# EAGLE design avoccado-avr-pcb-micro-a1 (EAGLE 7.2.0)
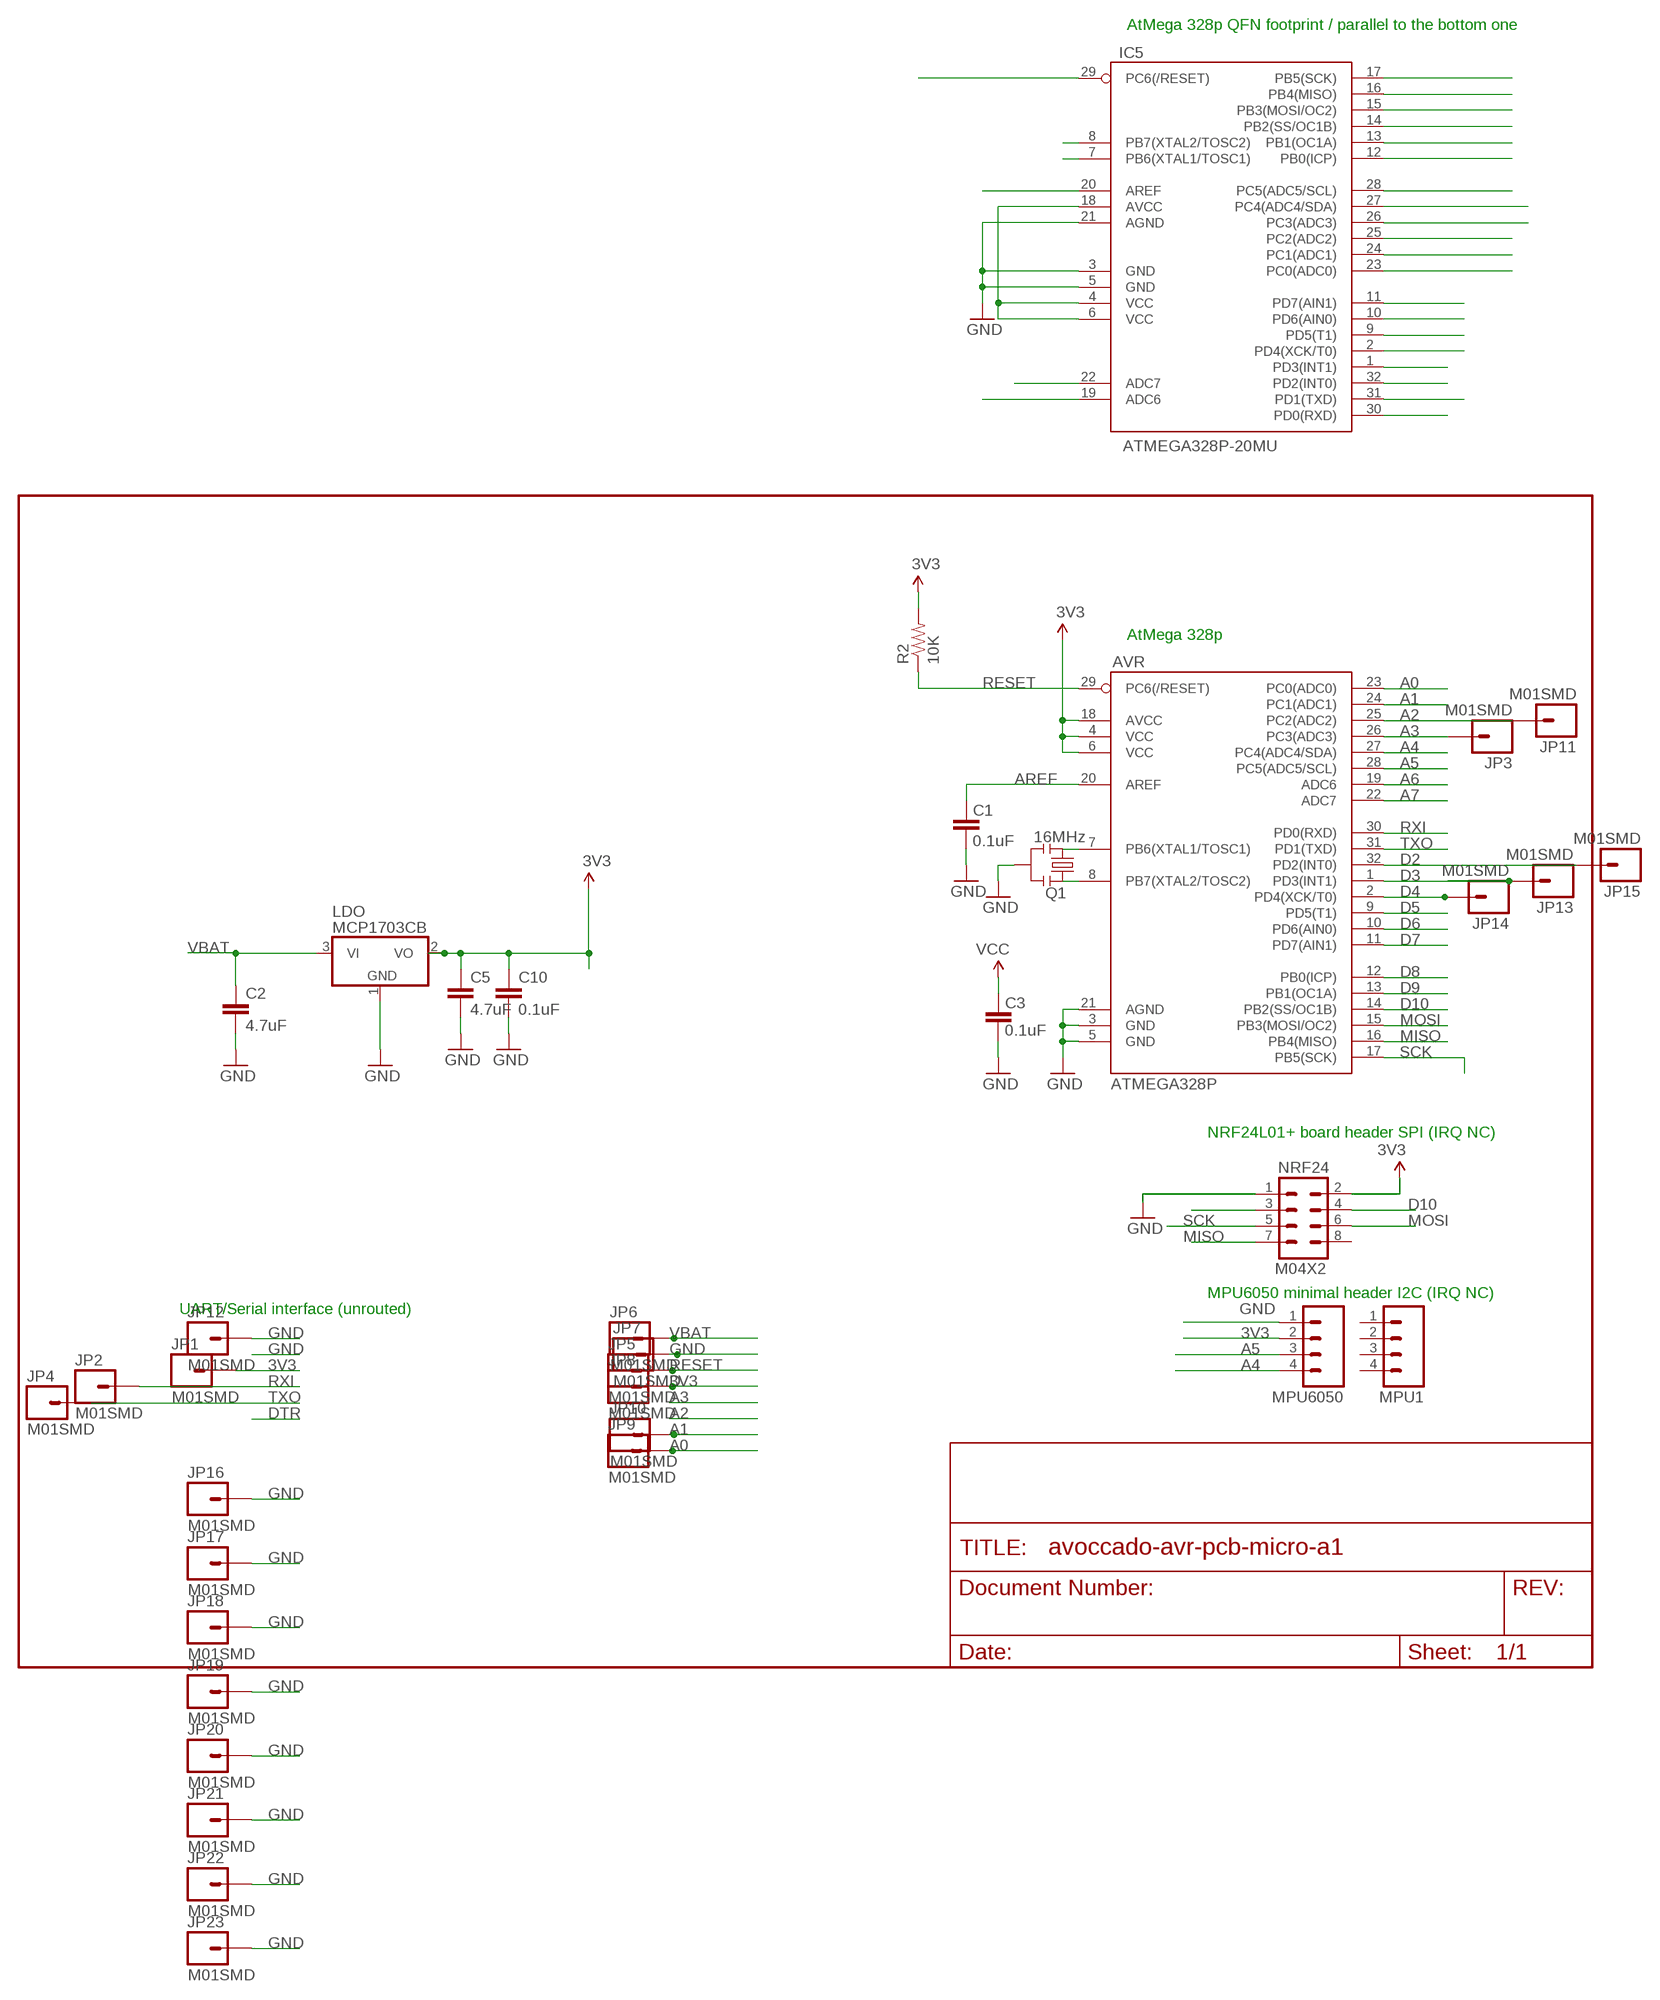
[diagram p0: schematic, sheet 1]

## Parts
AVR  ATMEGA328P  ATMEGA328_SMT  [TQFP32-08]
C1  0.1uF  CAP0402  [C0402]
C2  4.7uF  4.7UF-6.3V-10%(0603)0603  [0603-CAP]
C3  0.1uF  CAP0402  [C0402]
C5  4.7uF  4.7UF-6.3V-10%(0603)0603  [0603-CAP]
C10  0.1uF  CAP0402  [C0402]
IC5  ATMEGA328P-20MU  MEGA8-MI  [MLF32]
JP1  M01SMD  [LUXEON-PAD]
JP2  M01SMD  [LUXEON-PAD]
JP3  M01SMD  [LUXEON-PAD]
JP4  M01SMD  [LUXEON-PAD]
JP5  M01SMD  [LUXEON-PAD]
JP6  M01SMD  [LUXEON-PAD]
JP7  M01SMD  [LUXEON-PAD]
JP8  M01SMD  [LUXEON-PAD]
JP9  M01SMD  [LUXEON-PAD]
JP10  M01SMD  [LUXEON-PAD]
JP11  M01SMD  [LUXEON-PAD]
JP12  M01SMD  [LUXEON-PAD]
JP13  M01SMD  [LUXEON-PAD]
JP14  M01SMD  [LUXEON-PAD]
JP15  M01SMD  [LUXEON-PAD]
JP16  M01SMD  [LUXEON-PAD]
JP17  M01SMD  [LUXEON-PAD]
JP18  M01SMD  [LUXEON-PAD]
JP19  M01SMD  [LUXEON-PAD]
JP20  M01SMD  [LUXEON-PAD]
JP21  M01SMD  [LUXEON-PAD]
JP22  M01SMD  [LUXEON-PAD]
JP23  M01SMD  [LUXEON-PAD]
LDO  MCP1703CB  [SOT23]
MPU1  M041X04_NO_SILK  [1X04_NO_SILK]
MPU6050  M041X04_NO_SILK  [1X04_NO_SILK]
NRF24  M04X2  [2X4]
Q1  16MHz  RESONATORSMD  [RESONATOR-SMD]
R2  10K  RESISTOR0603  [0603-RES]

## Nets
3V3: AVR.4(VCC) AVR.6(VCC) AVR.18(AVCC) C3.2 C5.1 C10.1 IC5.4(VCC) IC5.6(VCC) IC5.18(AVCC) JP1.P$1 JP8.P$1 LDO.2(VO) MPU6050.2 NRF24.2 R2.2 ; supply symbol labelled VCC
A0: AVR.23(PC0(ADC0)) IC5.23(PC0(ADC0)) JP9.P$1
A1: AVR.24(PC1(ADC1)) IC5.24(PC1(ADC1)) JP10.P$1
A2: AVR.25(PC2(ADC2)) IC5.25(PC2(ADC2)) JP11.P$1
A3: AVR.26(PC3(ADC3)) IC5.26(PC3(ADC3)) JP3.P$1
A4: AVR.27(PC4(ADC4/SDA)) IC5.27(PC4(ADC4/SDA)) MPU6050.4
A5: AVR.28(PC5(ADC5/SCL)) IC5.28(PC5(ADC5/SCL)) MPU6050.3
A6: AVR.19(ADC6) IC5.19(ADC6)
A7: AVR.22(ADC7) IC5.22(ADC7)
AREF: AVR.20(AREF) C1.2 IC5.20(AREF)
D2: AVR.32(PD2(INT0)) IC5.32(PD2(INT0)) JP15.P$1
D3: AVR.1(PD3(INT1)) IC5.1(PD3(INT1)) JP13.P$1
D4: AVR.2(PD4(XCK/T0)) IC5.2(PD4(XCK/T0)) JP14.P$1
D5: AVR.9(PD5(T1)) IC5.9(PD5(T1))
D6: AVR.10(PD6(AIN0)) IC5.10(PD6(AIN0))
D7: AVR.11(PD7(AIN1)) IC5.11(PD7(AIN1))
D8: AVR.12(PB0(ICP)) IC5.12(PB0(ICP))
D9: AVR.13(PB1(OC1A)) IC5.13(PB1(OC1A)) NRF24.3
D10: AVR.14(PB2(SS/OC1B)) IC5.14(PB2(SS/OC1B)) NRF24.4
GND [vcc]: AVR.3(GND) AVR.5(GND) AVR.21(AGND) C1.1 C2.2 C3.1 C5.2 C10.2 IC5.3(GND) IC5.5(GND) IC5.21(AGND) JP7.P$1 JP12.P$1 JP16.P$1 JP17.P$1 JP18.P$1 JP19.P$1 JP20.P$1 JP21.P$1 JP22.P$1 JP23.P$1 LDO.1(GND) MPU6050.1 NRF24.1 Q1.2
MISO: AVR.16(PB4(MISO)) IC5.16(PB4(MISO)) NRF24.7
MOSI: AVR.15(PB3(MOSI/OC2)) IC5.15(PB3(MOSI/OC2)) NRF24.6
N$1: AVR.8(PB7(XTAL2/TOSC2)) IC5.8(PB7(XTAL2/TOSC2)) Q1.1
N$2: AVR.7(PB6(XTAL1/TOSC1)) IC5.7(PB6(XTAL1/TOSC1)) Q1.3
RESET: AVR.29(PC6(/RESET)) IC5.29(PC6(/RESET)) JP5.P$1 R2.1
RXI: AVR.30(PD0(RXD)) IC5.30(PD0(RXD)) JP2.P$1
SCK: AVR.17(PB5(SCK)) IC5.17(PB5(SCK)) NRF24.5
TXO: AVR.31(PD1(TXD)) IC5.31(PD1(TXD)) JP4.P$1
VBAT [vcc]: C2.1 JP6.P$1 LDO.3(VI)
Unconnected: MPU1.1 MPU1.2 MPU1.3 MPU1.4 NRF24.8

## Notes on the sheet
- AtMega 328p QFN footprint / parallel to the bottom one
- AtMega 328p
- NRF24L01+ board header SPI (IRQ NC)
- MPU6050 minimal header I2C (IRQ NC)
- UART/Serial interface (unrouted)

## Library data of the parts
AVR = SparkFun-DigitalIC:ATMEGA328_SMT: 32-Pin Atmega328 part Commonly used on Arduino compatible boards Available in QFP and QFN packages TQFP is IC-09069 QFN is non-stock; PROD_ID: IC-09069
C1 C3 C10 = SparkFun:CAP: Capacitor Standard 0603 ceramic capacitor, and 0.1" leaded capacitor.
C2 C5 = SparkFun-Capacitors:4.7UF-6.3V-10%(0603): CAP-08280; PROD_ID: CAP-08280
IC5 = idii:MEGA8: MICROCONTROLLER 8 Kbytes FLASH 1 kbytes SRAM 512 bytes EEPROM USART 6-channel 10 bit ADC 2-channel 8 bit ADC Source: avr.lbr
JP1-JP23 = SparkFun-Connectors:M01: Header 1 Standard 1-pin 0.1" header. Use with straight break away headers (SKU : PRT-00116), right angle break away headers (PRT-00553), swiss pins (PRT-00743), machine pins (PRT-00117), and female headers (PRT-00115).
LDO = linear:MCP1703: 250 mA, 16V, Low Quiescent Current LDO Regulator Source: http://ww1.microchip.com/downloads/en/DeviceDoc/22049b.pdf
MPU1 MPU6050 = SparkFun-Connectors:M04: Header 4 Standard 4-pin 0.1" header. Use with straight break away headers (SKU : PRT-00116), right angle break away headers (PRT-00553), swiss pins (PRT-00743), machine pins (PRT-00117), and female headers (PRT-00115). Molex polarized connector foot print use with SKU : PRT-08231 with associated crimp pins and housings. 1MM SMD Version SKU: PRT-10208
NRF24 = SparkFun-Connectors:M04X2: .1" header, two rows of four.
Q1 = SparkFun:RESONATOR: Resonator Small SMD resonator. This is the itty bitty 10/20MHz resonators with built in caps. CSTCE10M0G55 and CSTCE20M0V53. Footprint has been reviewed closely but hasn't been tested yet.
R2 = SparkFun-Resistors:RESISTOR: Resistor Basic schematic elements and footprints for 0603, 1206, and PTH resistors.

## Net classes
1 vcc: width 0.254 mm
3 usbvcc: width 0.203 mm, drill 0.61 mm, clearance 0.152 mm

## Board
Avoccado-avr controller
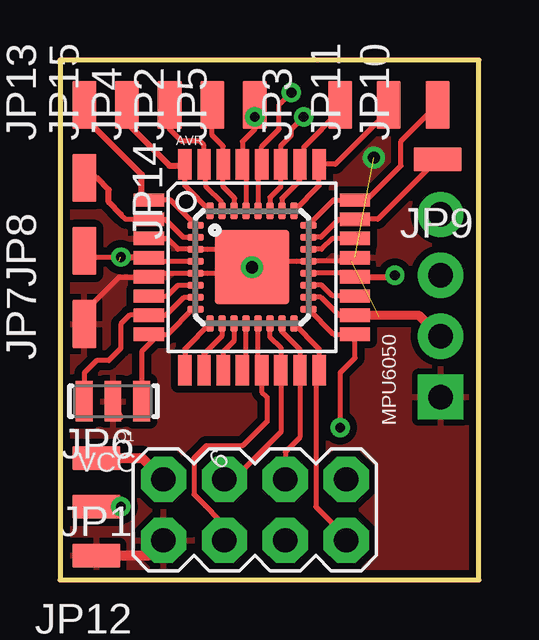
[diagram p1: board, top side]
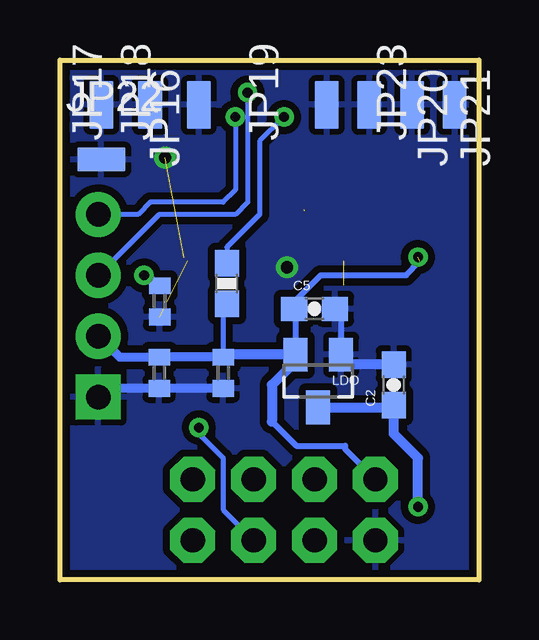
[diagram p2: board, bottom side, seen from below]

Size 17.48 x 21.68 mm. Coordinates in mm from the lower left corner, seen from the top.
Outline: 0,21.68 0,0 17.48,0 17.48,21.68 0,21.68
Copper layers (1*16): Top 0.035mm / dielectric 1.5mm / Bottom 0.035mm
Design rules "haka_35_l2": minimum track width 0.15mm, minimum drill 0.3mm, track to track 0.15mm, track to pad 0.15mm, pad to pad 0.15mm, via to via 0.15mm, smd to smd 0mil, copper to edge 0.2mm, drill to drill 0.2mm, minimum pad ring 0.2mm, minimum via ring 0.2mm, stop-mask expansion 0.1mm, vias tented up to drill 0mil, thermal gap 10mil

### Footprints (pad centres in the part's own frame; a part is rotated, then mirrored left to right if it is on the bottom)
TQFP32-08 = smd 1.27 x 0.559: 1 -4.293,2.8; 2 -4.293,2; 3 -4.293,1.2; 4 -4.293,0.4; 5 -4.293,-0.4; 6 -4.293,-1.2; 7 -4.293,-2; 8 -4.293,-2.8; 17 4.293,-2.8; 18 4.293,-2; 19 4.293,-1.2; 20 4.293,-0.4; 21 4.293,0.4; 22 4.293,1.2; 23 4.293,2; 24 4.293,2.8 | smd 0.559 x 1.27: 9 -2.8,-4.293; 10 -2,-4.293; 11 -1.2,-4.293; 12 -0.4,-4.293; 13 0.4,-4.293; 14 1.2,-4.293; 15 2,-4.293; 16 2.8,-4.293; 25 2.8,4.293; 26 2,4.293; 27 1.2,4.293; 28 0.4,4.293; 29 -0.4,4.293; 30 -1.2,4.293; 31 -2,4.293; 32 -2.8,4.293
C0402 = smd 0.7 x 0.9: 1 -0.65,0; 2 0.65,0
0603-CAP = smd 1.1 x 1: 1 -0.85,0; 2 0.85,0
MLF32 = smd 0.7 x 0.3: 1 -2.35,1.75; 2 -2.35,1.25; 3 -2.35,0.75; 4 -2.35,0.25; 5 -2.35,-0.25; 6 -2.35,-0.75; 7 -2.35,-1.25; 8 -2.35,-1.75; 17 2.35,-1.75; 18 2.35,-1.25; 19 2.35,-0.75; 20 2.35,-0.25; 21 2.35,0.25; 22 2.35,0.75; 23 2.35,1.25; 24 2.35,1.75 | smd 0.3 x 0.7: 9 -1.75,-2.35; 10 -1.25,-2.35; 11 -0.75,-2.35; 12 -0.25,-2.35; 13 0.25,-2.35; 14 0.75,-2.35; 15 1.25,-2.35; 16 1.75,-2.35; 25 1.75,2.35; 26 1.25,2.35; 27 0.75,2.35; 28 0.25,2.35; 29 -0.25,2.35; 30 -0.75,2.35; 31 -1.25,2.35; 32 -1.75,2.35 | smd 3.1 x 3.1: PAD 0,0
LUXEON-PAD = smd 2 x 1: P$1 0,0
SOT23 = smd 1 x 1.4: 1 -0.95,-1.1; 2 0.95,-1.1; 3 0,1.1
1X04_NO_SILK = drill 1.016 pad 1.88 square: 1 0,0 | drill 1.016 pad 1.88: 2 2.54,0; 3 5.08,0; 4 7.62,0
2X4 = drill 1.016 pad 1.88 octagon: 1 -3.81,-1.27; 2 -3.81,1.27; 3 -1.27,-1.27; 4 -1.27,1.27; 5 1.27,-1.27; 6 1.27,1.27; 7 3.81,-1.27; 8 3.81,1.27
RESONATOR-SMD = smd 0.7 x 1.7: 1 -1.2,0; 2 0,0; 3 1.2,0
0603-RES = smd 1.1 x 1: 1 -0.85,0; 2 0.85,0

### Placement (x,y rotation side)
AVR  8.01,13.04 0 top
C1  13.31,11.62 90 bottom
C2  3.56,8.13 90 bottom
C3  13.34,8.64 90 bottom
C5  6.86,11.3 0 bottom
C10  10.67,8.64 270 bottom
IC5  8.01,13.04 0 top
JP1  1.52,5.08 180 top
JP2  6.35,19.81 90 top
JP3  11.68,19.81 90 top
JP4  4.57,19.81 90 top
JP5  8.13,19.81 90 top
JP6  1.52,3.05 0 top
JP7  1.02,10.67 90 top
JP8  1.02,13.72 90 top
JP9  15.75,17.53 180 top
JP10  15.75,19.81 90 top
JP11  13.72,19.81 90 top
JP12  1.52,1.02 180 top
JP13  1.02,19.81 90 top
JP14  1.02,16.76 270 top
JP15  2.79,19.81 90 top
JP16  15.75,19.81 270 bottom
JP17  13.72,19.81 90 bottom
JP18  11.68,19.81 90 bottom
JP19  6.35,19.81 90 bottom
JP20  4.57,19.81 270 bottom
JP21  2.79,19.81 270 bottom
JP22  15.75,17.53 0 bottom
JP23  1.02,19.81 90 bottom
LDO  6.71,8.29 180 bottom
MPU1  32.64,12.19 90 top  (outside the outline)
MPU6050  15.88,7.62 90 top
NRF24  8.13,2.92 0 top
Q1  2.21,7.45 180 top
R2  10.52,12.36 270 bottom

### Tracks (layer width: path | path; a pad name or v marks a point on that pad's centre or on a via)
3V3  (via drill 0.41)  (2 unrouted)
  Top 0.203: AVR.18 11.63,11.04 10.88,11.79 IC5.18 | AVR.4 3.87,13.29 IC5.4 | AVR.6 4.47,11.84 4.92,12.29 IC5.6 | JP8.P$1 1.27,13.46 v2.54,13.46
  Top 0.254: 3.7,13.4 3.7,13.42 AVR.4 3.69,13.46 v2.54,13.46
  Top 0.381: AVR.18 14.97,11.04 MPU6050.2
  Top 0.406: JP1.P$1 3.43,5.08 NRF24.2
  Bottom 0.203: R2.2 10.67,11.35 C10.1
  Bottom 0.254: 8.64,6.6 7.62,5.59 5.59,5.59 5.59,5.46 NRF24.2 | 2.46,13.29 3.05,12.7 6.6,12.7 7.71,11.6 C5.1 7.66,11.25 LDO.2
  Bottom 0.381: C10.1 C3.2 | C3.2 13.71,9.29 | MPU6050.2 14.98,9.29 C3.2
  Bottom 0.406: C10.1 10.56,9.39 LDO.2 7.66,9.11 8.64,8.13 8.64,6.6
A0
  Top 0.203: IC5.23 10.88,14.29 11.63,15.04 AVR.23 13.26,15.04 JP9.P$1
A1
  Top 0.203: IC5.24 11.41,15.84 AVR.24 12.79,15.84 14.22,17.27 14.22,18.29 JP10.P$1
A2
  Top 0.203: IC5.25 10.81,16.44 AVR.25 11.49,17.33 13.72,19.56 JP11.P$1
A3
  Top 0.203: IC5.26 9.26,15.9 10.01,16.65 AVR.26 10.16,17.48 10.16,18.03 11.68,19.56 JP3.P$1
A4  (via drill 0.41)
  Top 0.203: IC5.27 8.76,15.94 9.21,16.39 AVR.27 9.21,18.1 9.65,18.54 9.65,18.8 v10.16,19.3
  Bottom 0.203: v10.16,19.3 10.16,16.26 10.67,15.75 13.72,15.75 14.22,15.24 MPU6050.4
A5  (via drill 0.41)
  Top 0.203: IC5.28 8.26,17.18 AVR.28 8.41,18.06 9.14,18.8 9.14,19.81 v9.65,20.32
  Bottom 0.203: v9.65,20.32 9.65,15.75 10.16,15.24 13.34,15.24 MPU6050.3
A6
  Top 0.203: AVR.19 11.36,11.84 10.91,12.29 IC5.19
A7
  Top 0.203: AVR.22 11.36,14.24 10.91,13.79 IC5.22
AREF  (via drill 0.41)
  Top 0.203: AVR.20 12.15,12.79 IC5.20
  Top 0.254: AVR.20 13.91,12.64 v13.97,12.7
  Bottom 0.254: v13.97,12.7 13.75,12.7 C1.2
D2
  Top 0.203: AVR.32 5.21,16.44 IC5.32
  Top 0.254: JP15.P$1 2.79,19.05 4.57,17.27 5.15,17.27 AVR.32
D3
  Top 0.203: AVR.1 4.61,15.84 IC5.1
  Top 0.254: AVR.1 3.41,15.84 3.41,16.91 1.02,19.3 JP13.P$1
D4
  Top 0.203: IC5.2 5.14,14.29 4.39,15.04 AVR.2 2.74,15.04 2.54,15.24
  Top 0.254: 2.54,15.24 2.03,15.75 2.03,16.26 1.52,16.76 JP14.P$1
D5
  Top 0.203: AVR.9 5.21,9.64 IC5.9
D6
  Top 0.203: AVR.10 6.01,9.42 6.76,10.17 IC5.10
D7
  Top 0.203: AVR.11 6.81,9.5 7.26,9.95 IC5.11
D8
  Top 0.203: AVR.12 7.76,8.89 IC5.12
D9
  Top 0.203: IC5.13 8.26,8.89 AVR.13 8.41,7.85 8.64,7.62 8.64,6.6 7.62,5.59 6.1,5.59 5.59,5.08 5.59,3.56 7.11,2.03 7.11,1.9 NRF24.3
D10
  Top 0.203: IC5.14 8.76,10.13 9.21,9.68 AVR.14 9.21,6.16 7.62,4.57 7.24,4.57 NRF24.4
GND  (via drill 0.51)  (2 unrouted)
  Top 0.203: AVR.3 4.47,14.24 4.92,13.79 IC5.3 7.26,13.79 7.29,13.76 7.76,13.29 | 7.76,13.29 IC5.21 12.15,13.29 AVR.21 | 7.76,13.29 7.26,12.79 IC5.5 3.87,12.79 AVR.5 2.48,12.64 1.02,11.18 JP7.P$1 | Q1.2 2.54,6.76
  Top 0.254: 7.29,13.76 7.11,13.93
  Top 0.406: JP12.P$1 3.68,1.02 NRF24.1
  Bottom 0.254: C5.2 5.76,11.05 LDO.1
  Bottom 0.381: C10.2 C3.1 15.48,7.99 MPU6050.1
  Bottom 0.406: C2.2 5.34,8.98 LDO.1
  other vias: 8.01,13.04 13.09,17.61
  pour Bottom (isolate 0.305): 0,-0.16 17.48,-0.16 17.57,21.27 -0.14,21.28
  pour Top (isolate 0.305): 0,21.84 0,0 17.27,0 17.27,21.84
MISO
  Top 0.203: AVR.16 10.81,9.64 IC5.16 | 10.83,8.73 10.67,8.57 10.67,3.05 11.94,1.78 NRF24.7
  Top 0.254: AVR.16 10.83,8.73
MOSI
  Top 0.203: IC5.15 9.26,10.35 10.01,9.6 AVR.15 10.01,5.95 9.4,5.33 NRF24.6
N$1
  Top 0.203: IC5.8 5.54,11.29 4.49,10.24 AVR.8 3.92,10.04 3.41,9.53 Q1.1
N$2
  Top 0.203: IC5.7 5.18,11.79 4.43,11.04 AVR.7 2.91,11.04 2.54,10.67 2.54,9.65 2.03,9.14 1.52,9.14 1.02,8.64 Q1.3
RESET  (via drill 0.41)
  Top 0.203: IC5.29 7.76,17.18 AVR.29 7.61,18.28 8.13,18.8 v8.13,19.3 JP5.P$1
  Bottom 0.203: v8.13,19.3 9.14,18.29 9.14,15.24 10.52,13.87 R2.1
RXI  (1 unrouted)
  Top 0.203: 7.29,15.42 7.29,15.91 6.81,16.39 AVR.30 6.81,18.08 6.35,18.54 JP2.P$1
SCK  (via drill 0.41)
  Top 0.203: IC5.17 11.41,10.24 AVR.17 12.3,9.25 11.68,8.64 v11.68,6.35
  Bottom 0.203: v11.68,6.35 11.68,6.1 10.67,5.08 10.67,2.92 NRF24.5
TXO
  Top 0.203: JP4.P$1 4.57,18.8 5.08,18.29 5.84,18.29 6.01,18.12 AVR.31 6.1,16.38 6.76,15.72 IC5.31
VBAT  (via drill 0.41)
  Top 0.406: JP6.P$1 v2.54,3.05
  Bottom 0.406: LDO.3 3.64,7.19 C2.1 3.56,6.1 2.54,5.08 v2.54,3.05

### Text on the board
tPlace: A1 | RST | VIB | TXO | RXI | BAT | A3 | VCC | 6
bPlace: A1
Measures: avoccado-avr-micro-a1